# Altium schematic sheet Sheet3.SchDoc
size A4; SheetNumber: 3; SheetTotal: 3
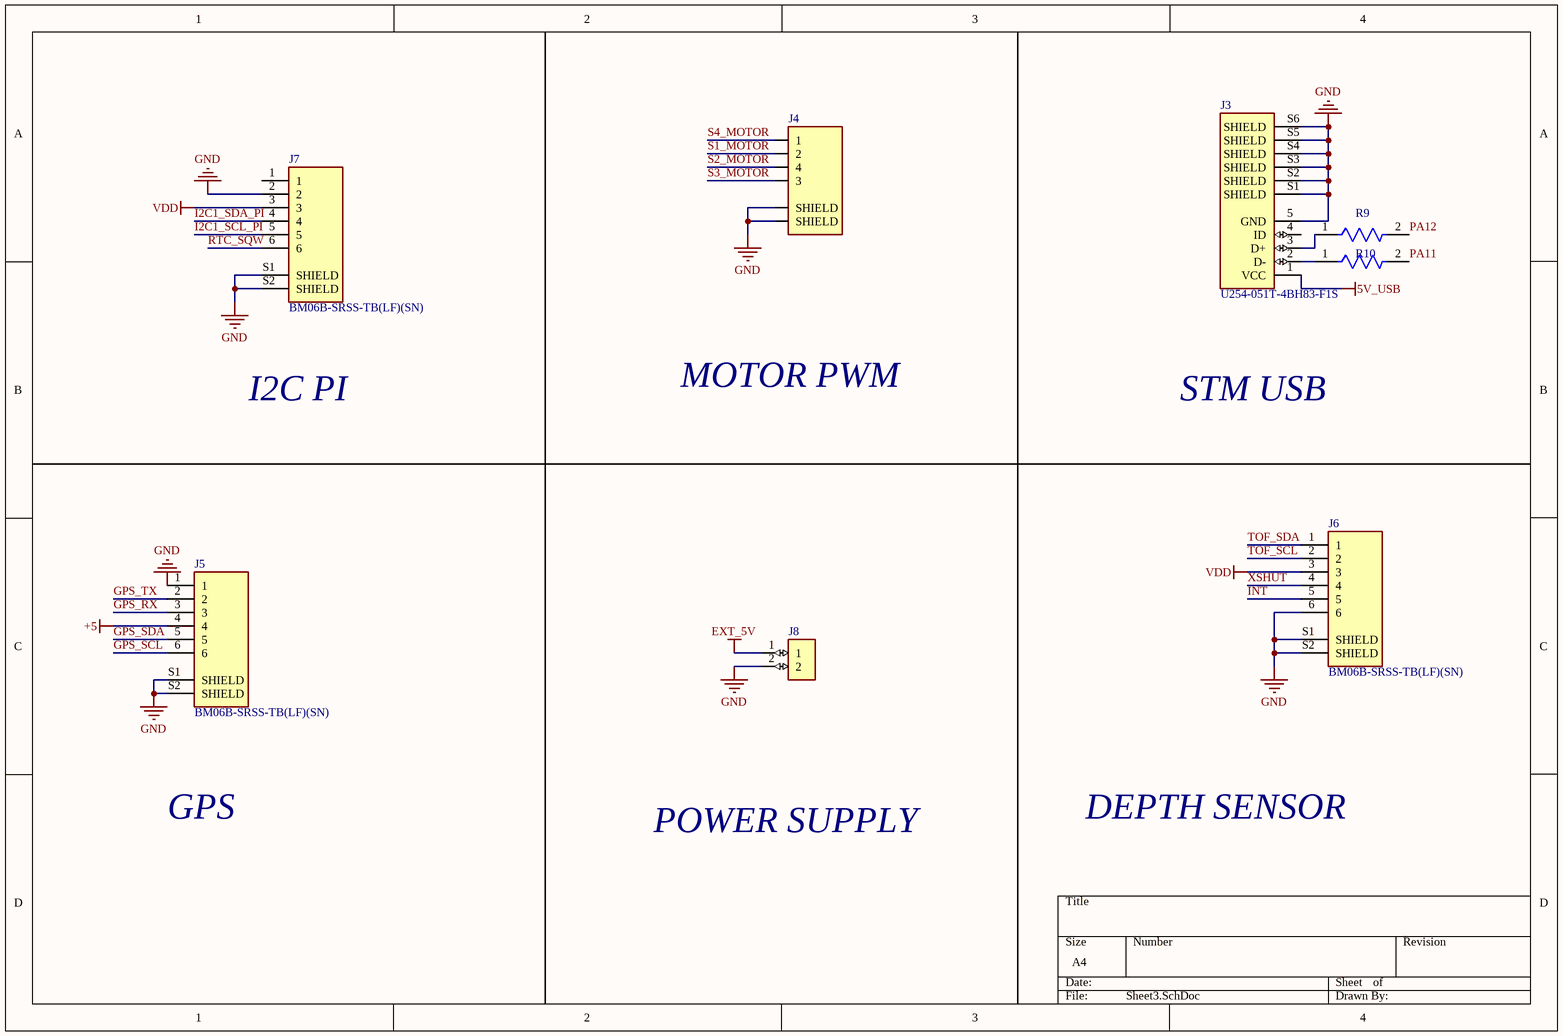
[diagram p0: Sheet3.SchDoc]

## Parts
J3  U254-051T-4BH83-F1S  [XKB_U254-051T-4BH83-F1S]
J4  SM04B-SRSS-TB(LF)(SN)  [JST_SM04B-SRSS-TB(LF)(SN)]  (value not drawn)
J5  BM06B-SRSS-TB(LF)(SN)  [JST_BM06B-SRSS-TB(LF)(SN)]
J6  BM06B-SRSS-TB(LF)(SN)  [JST_BM06B-SRSS-TB(LF)(SN)]
J7  BM06B-SRSS-TB(LF)(SN)  [JST_BM06B-SRSS-TB(LF)(SN)]
J8  SM02B-SRSS-TB(LF)(SN)  [SM02B-SRSS-TB(LF)(SN)]  (value not drawn)
R9  CPF0603B22RE1  [FP-CPF0603-MFG]  (value not drawn)
R10  CPF0603B22RE1  [FP-CPF0603-MFG]  (value not drawn)

## Nets
5V_USB: J3.1(VCC)
+5: J5.4
EXT_5V: J8.1
GND: J3.5(GND) J3.S1(SHIELD) J3.S2(SHIELD) J3.S3(SHIELD) J3.S4(SHIELD) J3.S5(SHIELD) J3.S6(SHIELD) J4.S1(SHIELD) J4.S2(SHIELD) J5.1 J5.S1(SHIELD) J5.S2(SHIELD) J6.6 J6.S1(SHIELD) J6.S2(SHIELD) J7.2 J7.S1(SHIELD) J7.S2(SHIELD) J8.2
VDD: J6.3 J7.3
GPS_RX: J5.3
GPS_SCL: J5.6
GPS_SDA: J5.5
GPS_TX: J5.2
I2C1_SCL_PI: J7.5
I2C1_SDA_PI: J7.4
INT: J6.5
PA11: R10.2
PA12: R9.2
RTC_SQW: J7.6
S1_MOTOR: J4.2
S2_MOTOR: J4.4
S3_MOTOR: J4.3
S4_MOTOR: J4.1
TOF_SCL: J6.2
TOF_SDA: J6.1
XSHUT: J6.4
NetJ3_2: J3.2(D-) R10.1
NetJ3_3: J3.3(D+) R9.1

Not connected (* = marked no-connect by the designer): J3 4(ID); J7 1

## Notes on the sheet
- I2C PI
- MOTOR PWM
- STM USB
- GPS
- POWER SUPPLY
- DEPTH SENSOR

## Library data of the parts
J3 = U254-051T-4BH83-F1S: USB - Micro B Female USB 2 5 SMD USB Connectors RoHS; MF: XKB Industrial Precision; SnapEDA_Link: https://www.snapeda.com/parts/U254-051T-4BH83-F1S/XKB+Industrial+Precision/view-part/?ref=snap; Package: Package; Value: *; MP: U254-051T-4BH83-F1S; Check_prices: https://www.snapeda.com/parts/U254-051T-4BH83-F1S/XKB+Industrial+Precision/view-part/?ref=eda
J4 = SM04B-SRSS-TB(LF)(SN): Connector Header Surface Mount, Right Angle 4 position 0.039 (1.00mm); MF: JST Sales; SnapEDA_Link: https://www.snapeda.com/parts/SM04B-SRSS-TB(LF)(SN)/JST/view-part/?ref=snap; Package: None; Value: *; MP: SM04B-SRSS-TB(LF)(SN); Check_prices: https://www.snapeda.com/parts/SM04B-SRSS-TB(LF)(SN)/JST/view-part/?ref=eda
J8 = SM02B-SRSS-TB(LF)(SN): Connector Header Surface Mount, Right Angle 2 position 0.039 (1.00mm); MF: JST Sales; SnapEDA_Link: https://www.snapeda.com/parts/SM02B-SRSS-TB(LF)(SN)/JST/view-part/?ref=snap; Package: None; Value: *; MP: SM02B-SRSS-TB(LF)(SN); Check_prices: https://www.snapeda.com/parts/SM02B-SRSS-TB(LF)(SN)/JST/view-part/?ref=eda
R9 R10 = CMP-03211-007811-1: RES SMD 22Ω 0.1% 1/16W 0603; Manufacturer: TE Connectivity; Temperature Coefficient: 25ppm/°C; Power Rating: 0.063W; Voltage Rating: 50V; Automotive: No; ComponentLink2Description: Datasheet; Package: CPF0603; Temperature Range High: +155°C; Device Class L1: Passive Components; Resistance: 22Ω; Device Class L3: Chip SMD Resistors; packaging: 1k Reel; Temperature: -55°C to +155°C; Octopart: https://octopart.com/cpf0603b22re1-te+connectivity-9539398; Manufacturer Part Number: CPF0603B22RE1; ComponentLink2URL: https://www.te.com/commerce/DocumentDelivery/DDEController?Action=showdoc&DocId=Data+Sheet%7F1773200%7FM%7Fpdf%7FEnglish%7FENG_DS_1773200_M.pdf%7F3-1676481-2; Value: 22Ω; Device Class L2: Resistors; Height: 0.55mm; RoHS: TRUE; Composition: Thin Film; Lead Free: Yes; octopart_url: https://octopart.com/cpf0603b22re1-te+connectivity-9539398; Tolerance: 0.1%; Ipc Land Pattern Name: RESC15580X45; Category: Res; Temperature Range Low: -55°C; Series: CPF
J5-J7 = BM06B-SRSS-TB(LF)(SN): Package: None; Price: None; Value: *; MP: BM06B-SRSS-TB(LF)(SN); Availability: Unavailable